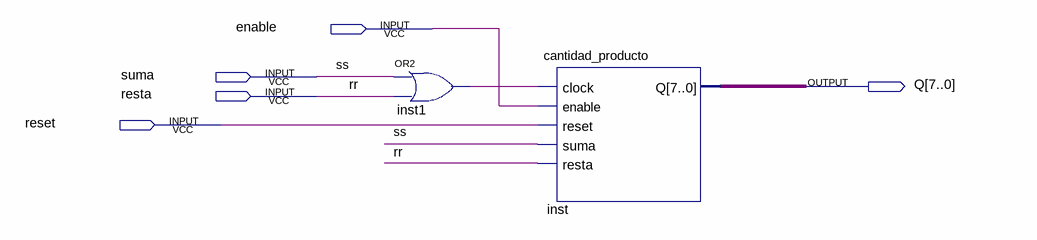
[diagram p0: schematic sheet]
// Quartus schematic bloqueRS.bdf as structural Verilog: 2 symbols, 5 pins
module bloqueRS (
  input  enable,
  input  suma,
  input  resta,
  input  reset,
  output [7:0] Q
);

  wire inst1_out;

  or inst1 (inst1_out, suma, resta);
  cantidad_producto inst (.clock(inst1_out), .enable(enable), .reset(reset), .suma(suma), .resta(resta), .Q(Q));

  // Other names for the same wires on the sheet: rr = resta; ss = suma
endmodule
